# EAGLE design Grove - DMX512 v1.0 (EAGLE 6.3)
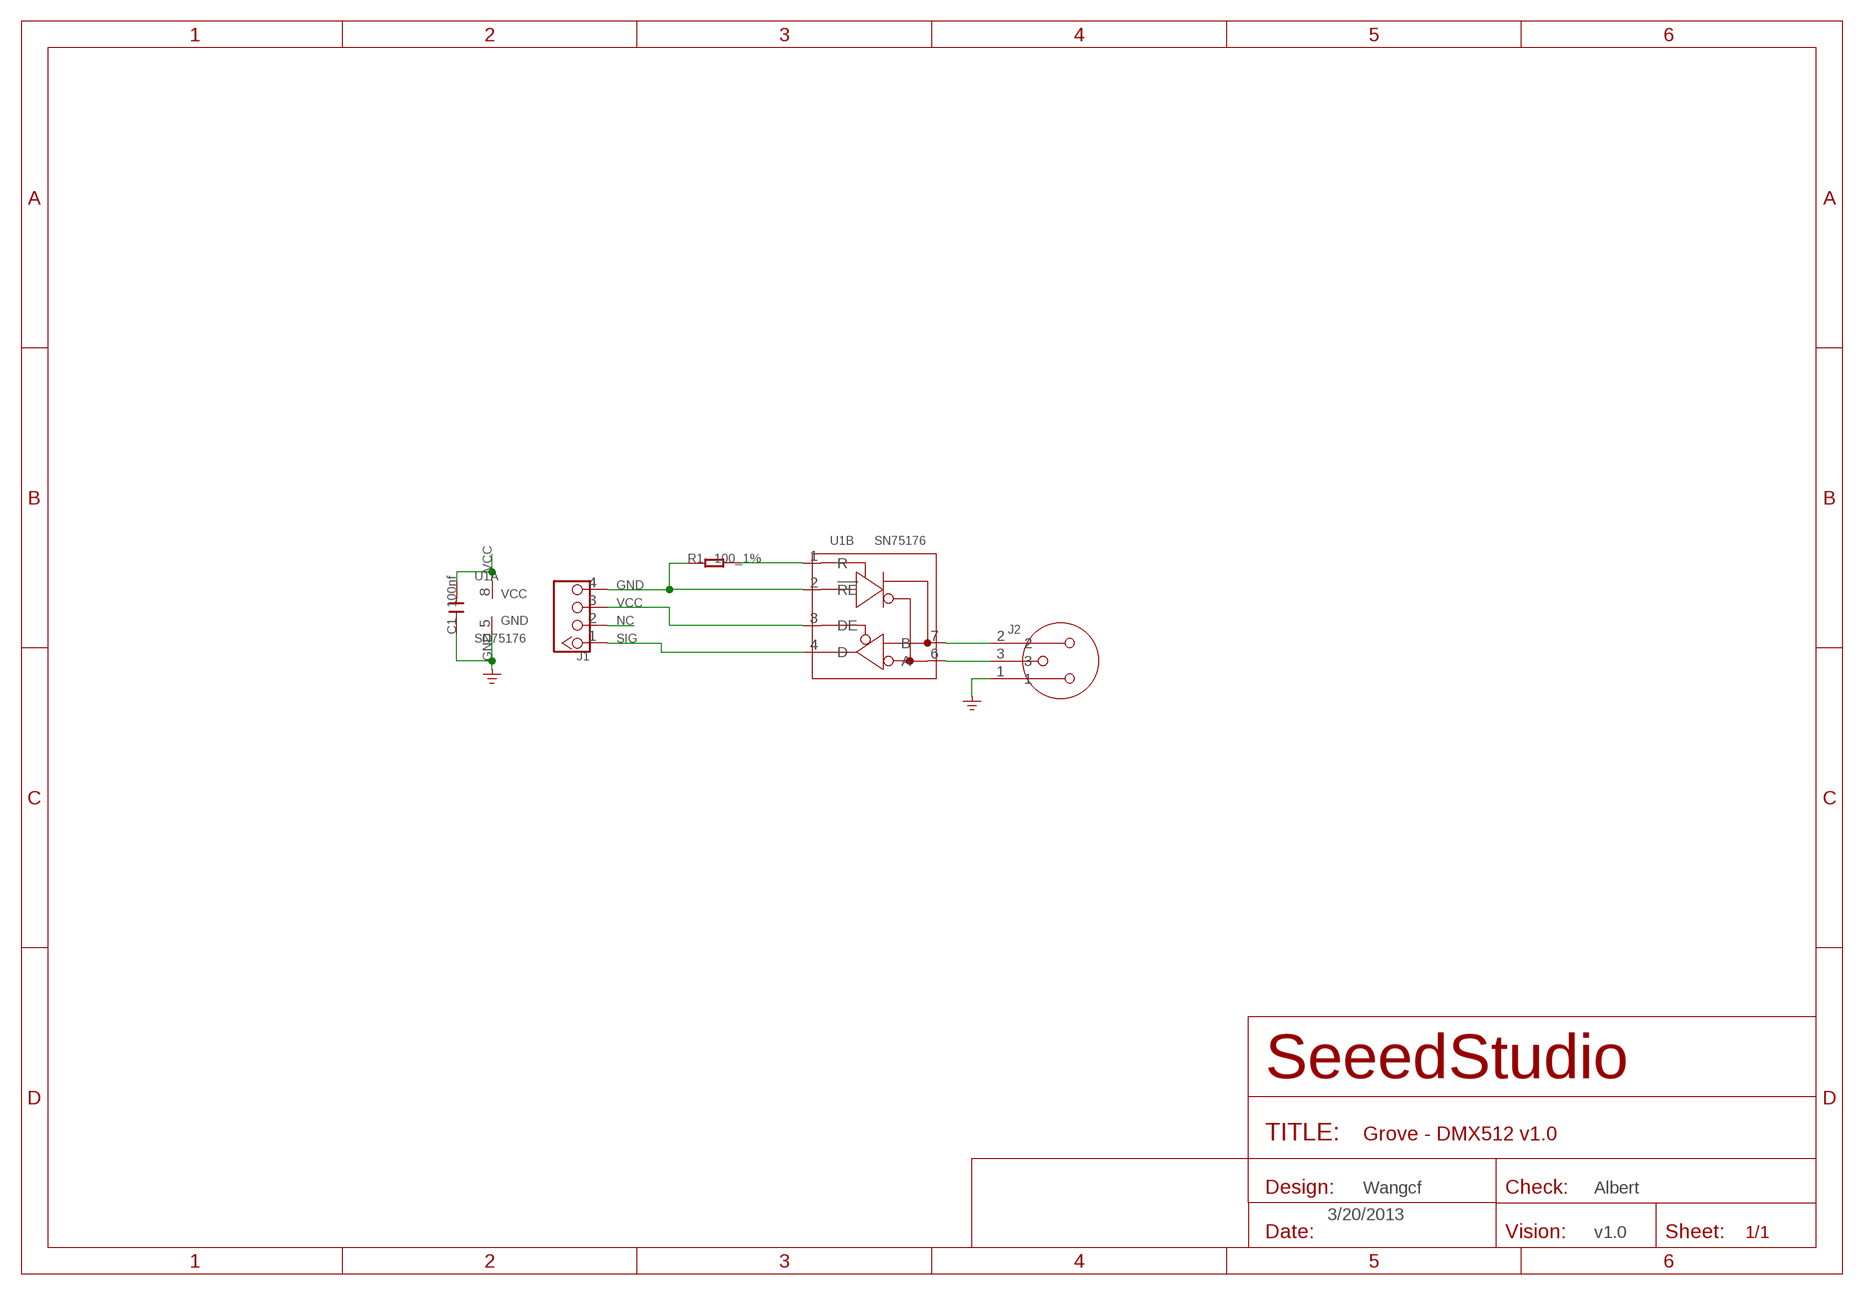
[diagram p0: schematic, sheet 1]

## Parts
C1  100nf  C-0603  [C0603]
J1  TWIG-4P-2.0-2.0  [4P-2.0]
J2  H22  [3P-4.0]
R1  100_1%  R-0603  [R0603]
U1  SN75176  SN75176'ADR'  [SOIC8]

## Nets
GND: C1.1 J1.4 J2.1 R1.1 U1.2(B:!RE) U1.5(A:GND)
N$1: R1.2 U1.1(B:R)
N$2: J2.3 U1.6(B:A)
N$3: J2.2 U1.7(B:B)
NC: J1.2
SIG: J1.1 U1.4(B:D)
VCC: C1.2 J1.3 U1.3(B:DE) U1.8(A:VCC)

## Notes on the sheet
- Wangcf | Albert
- 3/20/2013
- v1.0

## Library data of the parts
C1 = Discrete:C*: Ceramic Capacitors
J1 = Connector:TWIG-4P-2.0
J2 = Test:H22
R1 = Discrete:R*
U1 = template:SN75176: The SN75176A differential bus transceiver is a monolithic integrated circuit designed for bidirectional data communication on multipoint bus-transmission lines. It is designed for balanced transmission lines and meets ANSI Standard EIA/TIA-422-B and ITU Recommendation V.11. The SN75176A combines a 3-state differential line driver and a differential input line receiver, both of which operate from a single 5-V power supply. The driver and receiver have active-high and active-low enables, respectively, that can be externally connected together to function as a direction control. The driver differential outputs and the receiver differential inputs are connected internally to form differential input/output (I/O) bus ports that are designed to offer minimum loading to the bus whenever the driver is disabled or VCC = 0. These ports feature wide positive and negative common-mode voltage ranges making the device suitable for party-line applications. The driver is designed to handle loads up to 60 mA of sink or source current. The driver features positive- and negative-current limiting and thermal shutdown for protection from line fault conditions. Thermal shutdown is designed to occur at a junction temperature of approximately 150°C. The receiver features a minimum input impedance of 12 kW, an input sensitivity of ±200 mV, and a typical input hysteresis of 50 mV. The SN75176A can be used in transmission-line applications employing the SN75172 and SN75174 quadruple differential line drivers and SN75173 and SN75175 quadruple differential line receivers. The SN75176A is characterized for operation from 0°C to 70°C.

## Board
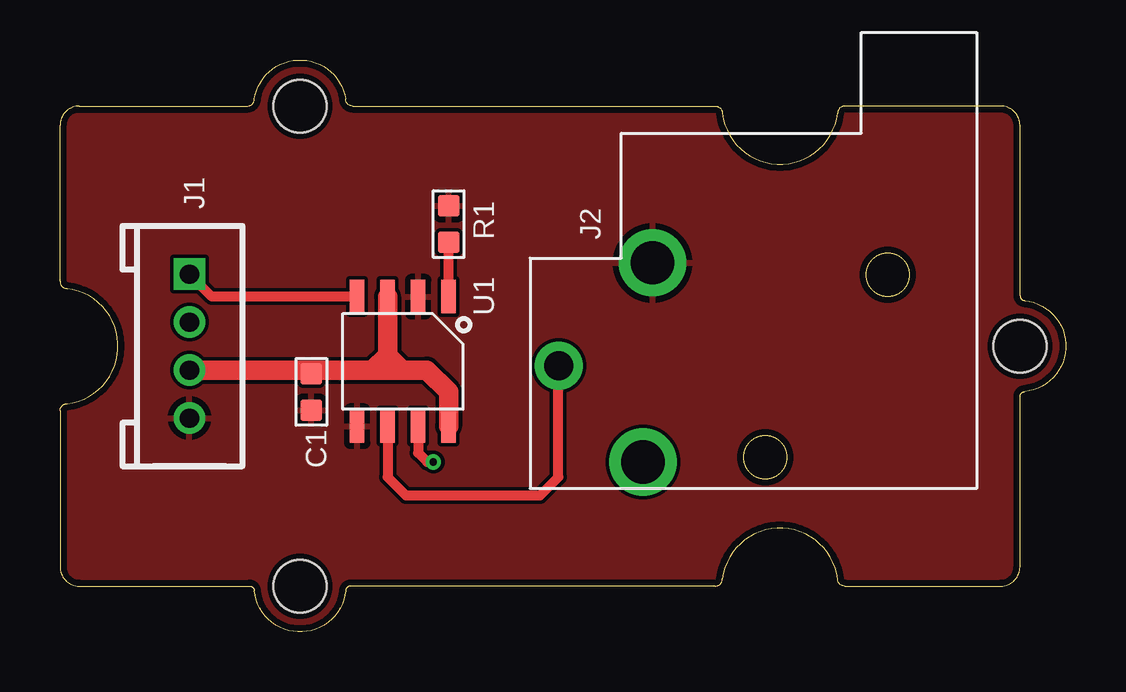
[diagram p1: board, top side]
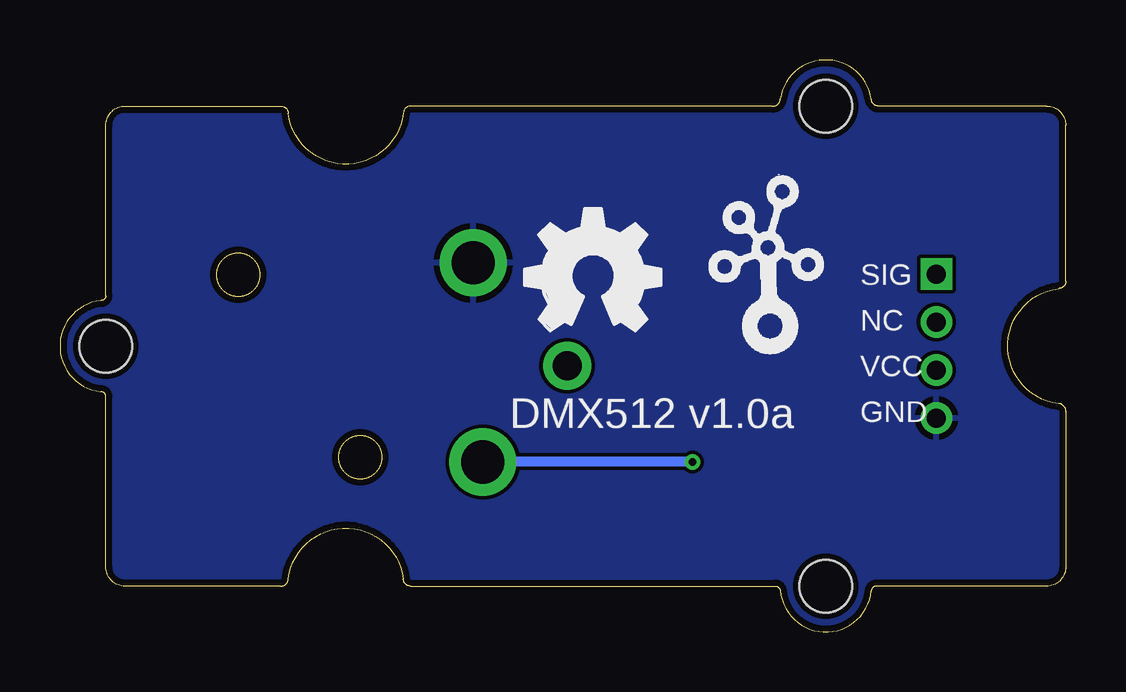
[diagram p2: board, bottom side, seen from below]

Size 41.91 x 23.83 mm. Coordinates in mm from the lower left corner, seen from the top.
Copper layers (1*16): Top 0.035mm / dielectric 1.5mm / Bottom 0.035mm
Design rules "SeeedStudio_rule_no_angle_090911 *": minimum track width 6mil, minimum drill 12mil, track to track 6mil, track to pad 6mil, pad to pad 6mil, via to via 6mil, smd to smd 0mil, copper to edge 10mil, drill to drill 10mil, minimum pad ring 10mil, minimum via ring 6mil, stop-mask expansion 2mil, vias tented up to drill 25mil, thermal gap 10mil

### Footprints (pad centres in the part's own frame; a part is rotated, then mirrored left to right if it is on the bottom)
C0603 = smd 0.889 x 0.889: 1 -0.762,0; 2 0.762,0
4P-2.0 = drill 0.8 pad 1.27 square: 1 -3,0 | drill 0.8 pad 1.27: 2 -1,0; 3 1,0; 4 3,0
3P-4.0 = drill 1.8 pad 2.8: 1 -2.2,-4.2; 2 6.1,-4.6 | drill 1.2 pad 2: 3 2.086,-8.112
R0603 = smd 0.889 x 0.889: 1 -0.762,0; 2 0.762,0
SOIC8 = smd 0.6 x 1.4: 1 -1.905,-2.7; 2 -0.635,-2.7; 3 0.635,-2.7; 4 1.905,-2.7; 5 1.905,2.7; 6 0.635,2.7; 7 -0.635,2.7; 8 -1.905,2.7
2U-DIM-W/DRILL = hole 2.2: -10,-10; -10,10; 20,0

### Placement (x,y rotation side)
C1  10.47,10 90 top
J1  5.39,11.91 270 top
J2  28.89,13.18 270 top
R1  16.19,16.99 270 top
U1  14.29,11.27 180 top
U$4  [2U-DIM-W/DRILL]  20,11.91 0 top
U$5  [OSHW_FILLX200_NOTEXT]  22.54,12.54 0 bottom
U$6  [TWIGLOGO]  12.38,12.54 0 bottom

### Tracks (layer width: path | path; a pad name or v marks a point on that pad's centre or on a via)
GND
  pour Top: -2.86,23.97 42.86,23.97 42.86,-0.16 -2.86,-0.16
  pour Bottom: -2.86,23.97 42.86,23.97 42.86,-0.16 -2.86,-0.16
N$1
  Top 0.406: U1.1 R1.2
N$2
  Top 0.406: U1.6 13.65,6.45 14.41,5.69 20,5.69 20.76,6.45 20.76,11.08 J2.3
N$3  (via drill 0.3 pad 0.64)
  Top 0.406: v15.55,7.08 15.3,7.08 14.92,7.46 U1.7
  Bottom 0.406: v15.55,7.08 J2.2
SIG
  Top 0.406: U1.4 6.33,13.97 J1.1
VCC
  Top 0.813: J1.3 10.33,10.91 | 10.33,10.91 C1.2 | 10.33,10.91 13.65,10.91 | 13.65,10.91 14.2,10.91 | 14.2,10.91 15.29,10.91 16.19,10 U1.8 | U1.3 13.65,11.53 | 13.65,11.53 13.65,10.91 | 14.2,10.91 14.2,10.98 13.65,11.53 | 13.65,11.53 13.02,10.89

### Text on the board
bPlace: SIG | NC | VCC | GND | DMX512 v1.0a